# Altium schematic sheet EmgFilterModule.SchDoc
size A4; SheetNumber: 1; SheetTotal: 1
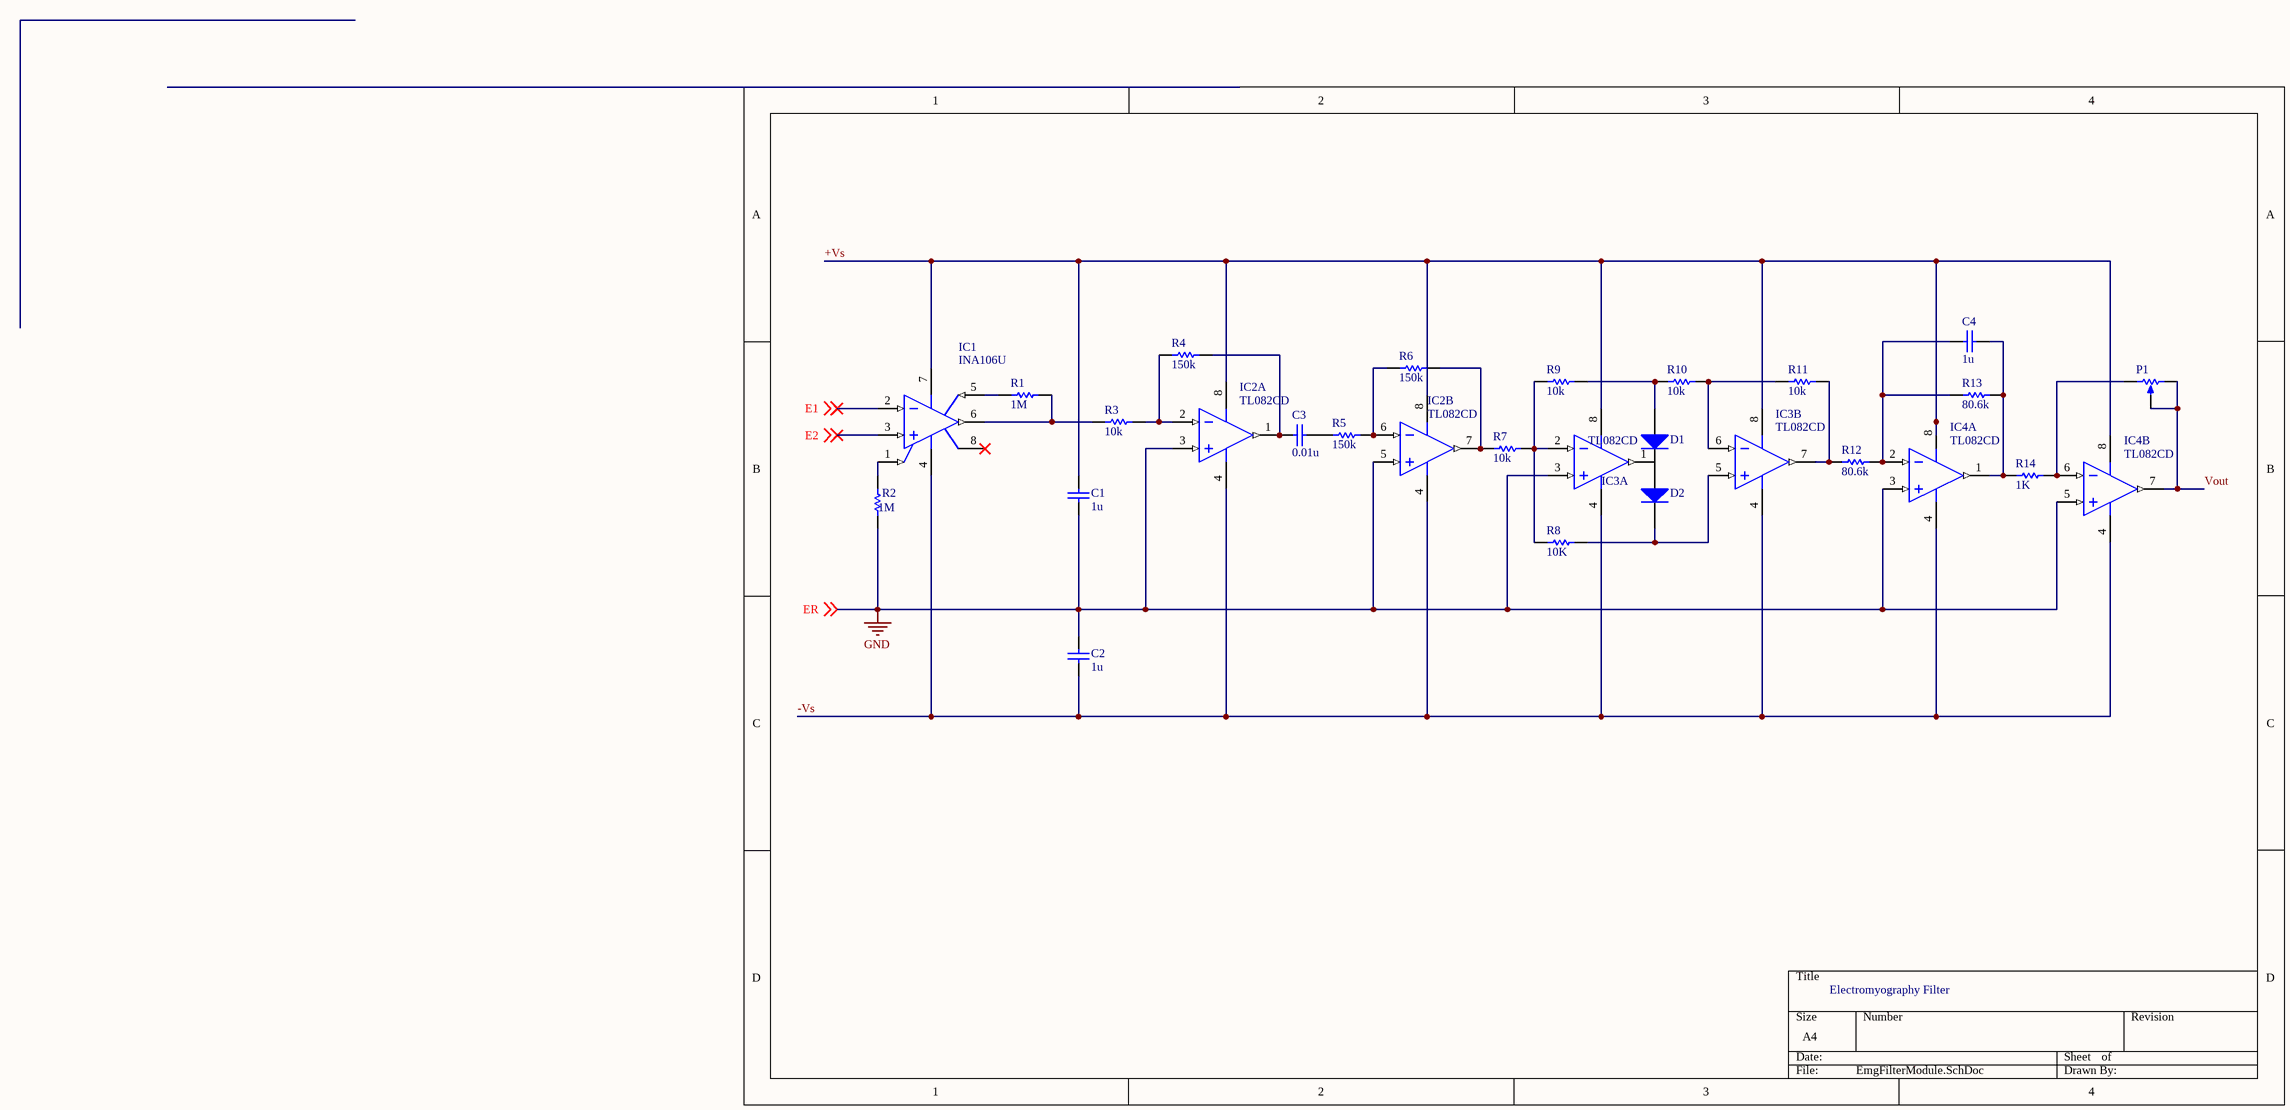
[diagram p0: EmgFilterModule.SchDoc]

## Parts
C1  value 1u  (hidden comment: Capacitor)
C2  value 1u  (hidden comment: Capacitor)
C3  value 0.01u  (hidden comment: Capacitor)
C4  value 1u  (hidden comment: Capacitor)
D1  Diode  (value not drawn)
D2  Diode  (value not drawn)
IC1  INA106U  [D0008A_M]
IC2  TL082CD  [D0008A_L]  (parts A,B of 2)
IC3  TL082CD  [D0008A_L]  (parts A,B of 2)
IC4  TL082CD  [D0008A_L]  (parts A,B of 2)
P1  Potentiometer  (value not drawn)
R1  value 1M  (hidden comment: Resistor)
R2  value 1M  (hidden comment: Resistor)
R3  value 10k  (hidden comment: Resistor)
R4  value 150k  (hidden comment: Resistor)
R5  value 150k  (hidden comment: Resistor)
R6  value 150k  (hidden comment: Resistor)
R7  value 10k  (hidden comment: Resistor)
R8  value 10K  (hidden comment: Resistor)
R9  value 10k  (hidden comment: Resistor)
R10  value 10k  (hidden comment: Resistor)
R11  value 10k  (hidden comment: Resistor)
R12  value 80.6k  (hidden comment: Resistor)
R13  value 80.6k  (hidden comment: Resistor)
R14  value 1K  (hidden comment: Resistor)

## Nets
GND: C1.1 C2.2 IC2.3(IN1+) IC2.5(IN2+) IC3.3(IN1+) IC4.3(IN1+) IC4.5(IN2+) R2.1 ; off-sheet ER  [also labelled ER]
+Vs: C1.2 IC1.7(V+) IC2.8(VCC+) IC3.8(VCC+) IC4.8(VCC+)
-Vs: C2.1 IC1.4(V-) IC2.4(VCC-) IC3.4(VCC-) IC4.4(VCC-)
E1: IC1.2(IN-) ; off-sheet E1
E2: IC1.3(IN+) ; off-sheet E2
Vout: IC4.7(OUT2) P1.2(BOT) P1.3(TAP)
NetC3_1: C3.1 IC2.1(OUT1) R4.2
NetC3_2: C3.2 R5.1
NetC4_1: C4.1 IC4.2(IN1-) R12.2 R13.1
NetC4_2: C4.2 IC4.1(OUT1) R13.2 R14.1
NetD1_1: D1.1(A) R9.2 R10.1
NetD2_1: D2.1(A) IC3.1(OUT1)
NetD2_2: D2.2(K) IC3.5(IN2+) R8.2
NetIC1_1: IC1.1(REF) R2.2
NetIC1_5: IC1.5(SENSE) R1.1
NetIC1_6: IC1.6(OUT) R1.2 R3.1
NetIC2_2: IC2.2(IN1-) R3.2 R4.1
NetIC2_6: IC2.6(IN2-) R5.2 R6.1
NetIC2_7: IC2.7(OUT2) R6.2 R7.1
NetIC3_2: IC3.2(IN1-) R7.2 R8.1 R9.1
NetIC3_6: IC3.6(IN2-) R10.2 R11.1
NetIC3_7: IC3.7(OUT2) R11.2 R12.1
NetIC4_6: IC4.6(IN2-) P1.1(TOP) R14.2

Not connected (* = marked no-connect by the designer): D1 2(K); IC1 8(NC)*

## Notes on the sheet
- Electromyography Filter

## Library data of the parts
C1-C4 = Capacitor: SimulationGenericComponent: True
D1 D2 = Diode: AF: 1; BV: 0; BV_MAX: 1e99; EG: 1.11; FC: 0.5; IBV: 0.001; ISR: 1e-14; MJSW: 0.33; NTUN: 30; TNOM: 27; XTI: 3; SimulationGenericComponent: True; CJO: 0; CJP: 0; CTA: 0; CTP: 0; FCS: 0.5; FV_MAX: 1e99; IKF: 0; IKR: 0; JSW: 0; JTUN: 0; JTUNSW: 0; KEG: 1; KF: 0; LEVEL: 1; N: 1; NBV: 1; NR: 1; NS: 1; PHP: 1; RS: 0; TCV: 0; TLEV: 0; TLEVC: 0; TM1: 0; TM2: 0; TPB: 0; TPHP: 0; TRS: 0; TRS2: 0; TT: 0; TTT1: 0; TTT2: 0; VJ: 1; XTITUN: 3; IS: 1e-14
IC1 = CMP-0985-00082-2: Precision Fixed-Gain Differential Amplifier, -40 to 85 degC, 8-pin SOIC (D8), Green (RoHS & no Sb/Br); Manufacturer: Texas Instruments; Gain(V/V): 10; Input Offset (+/-)(Max)(uV): 200; SubFamily: Difference Amplifier; Number of Channels: 1; CMRR(Min)(dB): 86; Vs(Max)(V): 36; Slew Rate(Typ)(V/us): 3; Code_JEDEC: MS-012; Mounting Technology: Surface Mount; PackageReference: D0008A; ComponentLink3URL: http://www.ti.com/litv/pdf/msoi002j; Vs(Min)(V): 10; DatasheetVersion: SBOS152A; PartNumber: INA106U; ComponentLink2URL: http://www.ti.com/general/docs/lit/getliterature.tsp?genericPartNumber=INA106&fileType=pdf; ComponentLink3Description: Package Specification; Eco-Plan: Green (RoHS & no Sb/Br); PackageDescription: 8-Pin Plastic Small Outline, Body 4.9 x 3.9 mm, Pitch 1.27 mm; PackageVersion: 4040047-3/M, 06/2011; ComponentLink2Description: Datasheet; ComponentLink1URL: http://www.ti.com/; ComponentLink1Description: Manufacturer URL
IC2-IC4 = CMP-0017-00402-2: JFET-Input Operational Amplifier, 7 to 36 V, 0 to 70 degC, 8-pin SOIC (D8), Green (RoHS & no Sb/Br); Manufacturer: Texas Instruments; Sub Family: General Purpose Amplifier, High Supply Voltage Amplifier (>=30V); Iq per channel(Max)(mA): 2.8; Number of Channels: 2; GBW(Typ)(MHz): 3; Rating: Catalog; Offset Drift(Typ)(uV/C): 18; Total Supply Voltage(Min)(+5V is 5, +/-5V is 10): 7; Total Supply Voltage(Max)(+5V is 5, +/-5V is 10): 36; CMRR(Min)(dB): 70; IIB(Max)(pA): 400; Vio (25C)(Max)(mV): 15; Slew Rate(Typ)(V/us): 13; ComponentLink3Description: Package Specification; ComponentLink2URL: http://www.ti.com/lit/ds/symlink/tl082.pdf; Code_JEDEC: MS-012; ComponentLink2Description: Datasheet; PackageReference: D0008A; ComponentLink1URL: http://www.ti.com/; PackageDescription: 8-Pin Plastic Small Outline, Body 4.9 x 3.9 mm, Pitch 1.27 mm; Mounting Technology: Surface Mount; ComponentLink1Description: Manufacturer URL; Vn at 1kHz(Typ)(nV/rtHz): 18; PartNumber: TL082CD; PackageVersion: 4040047-3/M, 06/2011; ComponentLink3URL: http://www.ti.com/litv/pdf/msoi002j; Eco-Plan: Green (RoHS & no Sb/Br); DatasheetVersion: SLOS081G
P1 = Potentiometer: value: 100k; position: 0.5; SimulationGenericComponent: True
R1-R14 = Resistor: TC1: 0; SimulationGenericComponent: True; TC2: 0